# EAGLE design Neato Laser USB (EAGLE 6.2)
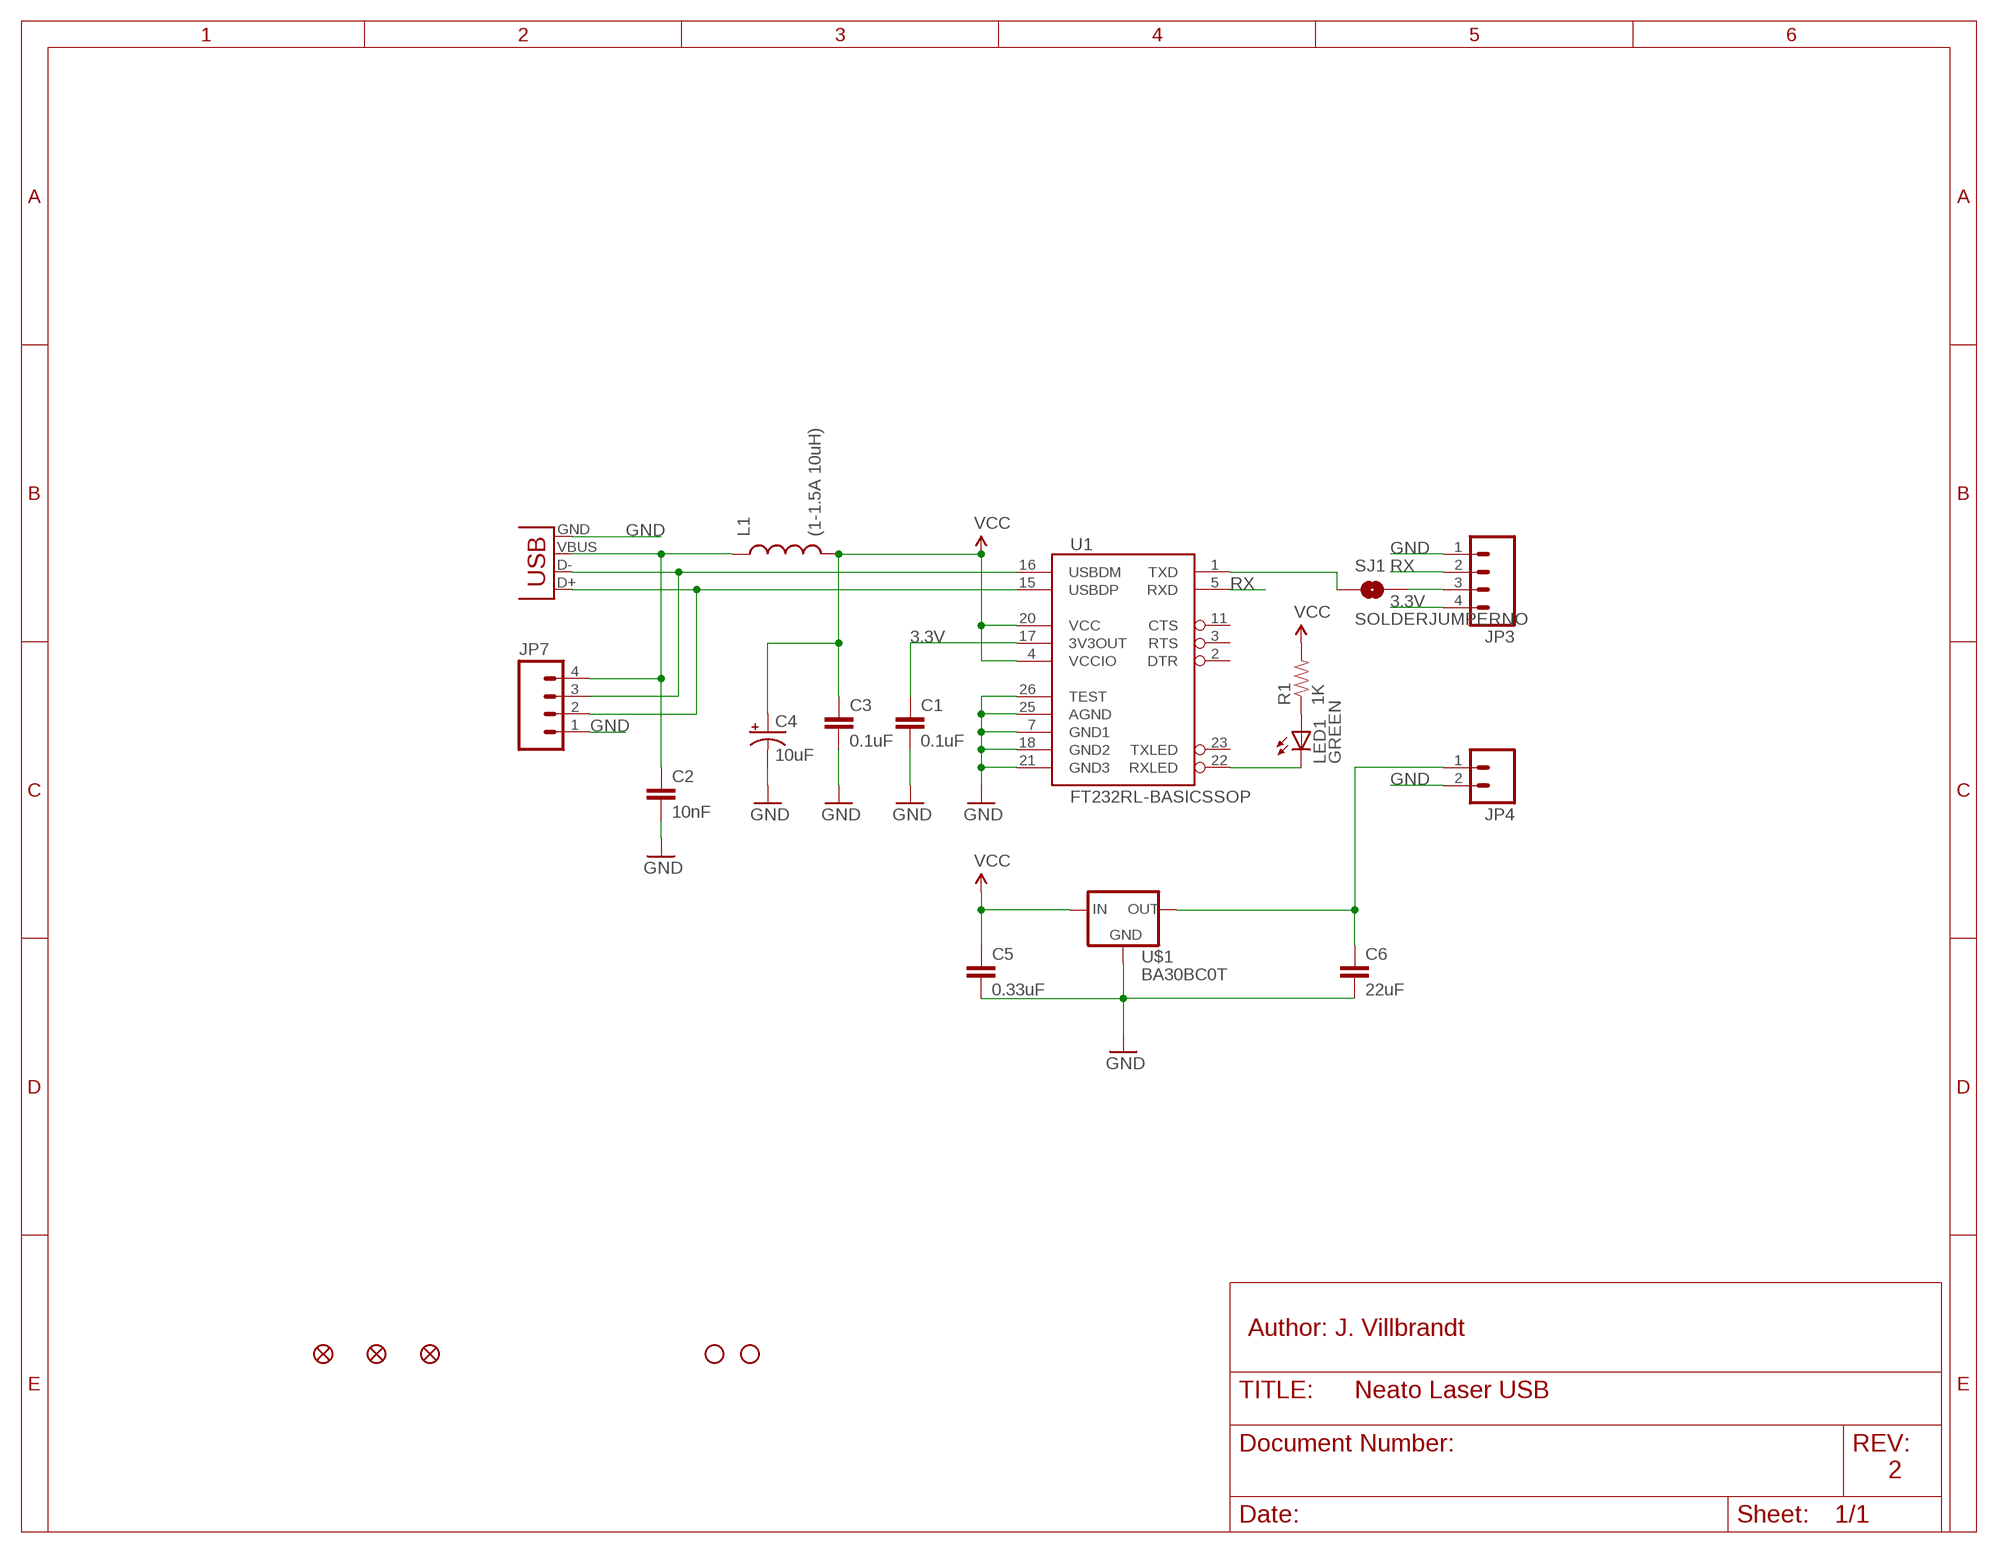
[diagram p0: schematic, sheet 1]

## Parts
C1  0.1uF  CAP0603-CAP  [0603-CAP]
C2  10nF  CAP0603-CAP  [0603-CAP]
C3  0.1uF  CAP0603-CAP  [0603-CAP]
C4  10uF  CAP_POL1206  [EIA3216]
C5  0.33uF  CAP0603-CAP  [0603-CAP]
C6  22uF  CAP0603-CAP  [0603-CAP]
JP1  STAND-OFF  [STAND-OFF]
JP2  STAND-OFF  [STAND-OFF]
JP3  M04JST-PTH  [JST-4-PTH]
JP4  M02JST-PTH-2  [JST-2-PTH]
JP5  FIDUCIAL1X2.5  [FIDUCIAL-1X2.5]
JP6  FIDUCIAL1X2.5  [FIDUCIAL-1X2.5]
JP7  M04PTH  [1X04]
JP8  FIDUCIAL1X2.5  [FIDUCIAL-1X2.5]
L1  (1-1.5A 10uH)  INDUCTOR0603  [0603]
LED1  GREEN  LED0603  [LED-0603]
R1  1K  RESISTOR0402-RES  [0402-RES]
SJ1  SOLDERJUMPERNO  [SJ_2S-NO]
U1  FT232RL-BASICSSOP  [SSOP28DB]
U$1  BA30BC0T  BA15BC0WT  [78XXL]
X1  USBSMD  [USB-MINIB]

## Nets
3.0V: C6.1 JP4.1 U$1.OUT
3.3V: C1.1 JP3.4 U1.17(3V3OUT)
GND: C1.2 C2.2 C3.2 C4.C(-) C5.2 C6.2 JP3.1 JP4.2 JP7.1 U1.7(GND1) U1.18(GND2) U1.21(GND3) U1.25(AGND) U1.26(TEST) U$1.GND X1.GND
N$1: JP7.3 U1.16(USBDM) X1.D-
N$2: JP7.2 U1.15(USBDP) X1.D+
N$3: C2.1 JP7.4 L1.1 X1.VBUS
N$4: LED1.C U1.22(RXLED)
N$5: LED1.A R1.1
N$6: JP3.3 SJ1.2
N$7: SJ1.1 U1.1(TXD)
RX: JP3.2 U1.5(RXD)
VCC: C3.1 C4.A(+) C5.1 L1.2 R1.2 U1.4(VCCIO) U1.20(VCC) U$1.IN
Unconnected: U1.2(DTR) U1.3(RTS) U1.11(CTS) U1.23(TXLED)

## Notes on the sheet
- Author: J. Villbrandt
- 2

## Library data of the parts
C1-C3 C5 C6 = SparkFun:CAP: Capacitor Standard 0603 ceramic capacitor, and 0.1" leaded capacitor.
C4 = SparkFun:CAP_POL: Capacitor Polarized These are standard SMD and PTH capacitors. Normally 10uF, 47uF, and 100uF in electrolytic and tantalum varieties. Always verify the external diameter of the through hole cap, it varies with capacity, voltage, and manufacturer. The EIA devices should be standard.
JP1 JP2 = SparkFun:STAND-OFF: Stand Off This is the mechanical footprint for a #4 phillips button head screw. Use the keepout ring to avoid running the screw head into surrounding components. SKU : PRT-00447
JP3 JP7 = SparkFun:M04: Header 4 Standard 4-pin 0.1" header. Use with straight break away headers (SKU : PRT-00116), right angle break away headers (PRT-00553), swiss pins (PRT-00743), machine pins (PRT-00117), and female headers (PRT-00115). Molex polarized connector foot print use with SKU : PRT-08231 with associated crimp pins and housings. 1MM SMD Version SKU: PRT-10208
JP4 = SparkFun:M02: Header 2 Standard 2-pin 0.1" header. Use with straight break away headers (SKU : PRT-00116), right angle break away headers (PRT-00553), swiss pins (PRT-00743), machine pins (PRT-00117), and female headers (PRT-00115). Molex polarized connector foot print use with SKU : PRT-08233 with associated crimp pins and housings.
JP5 JP6 JP8 = SparkFun:FIDUCIAL: Fiducial Alignment Points Various fiducial points for machine vision alignment.
L1 = SparkFun:INDUCTOR: Inductors Basic Inductor/Choke - 0603 and 1206. Footprints are not proven and vary greatly between part numbers.
LED1 = SparkFun:LED: LEDs Standard schematic elements and footprints for 5mm, 3mm, 1206, and 0603 sized LEDs. 5mm - Spark Fun Electronics SKU : COM-00529 (and others)
R1 = SparkFun:RESISTOR: Resistor Basic schematic elements and footprints for 0603, 1206, and PTH resistors.
SJ1 = SparkFun:SOLDERJUMPER: Solder Jumper Standard SMD solder jumper. Used to automate production. Two varients : Normally Open and Normally Closed are the same, but have different paste layers. NC will have a large amount of paste and should jumper during reflow.
U1 = SparkFun:FT232RL-BASIC: USB UART This is the simplified version of the FT232RL unit. Only what you need, nothing you don't. Spark Fun Electronics SKU : COM-00650
U$1 = Josh:BA15BC0WT: LD1117VXX voltage regulator. We carry the 3.3V version (COM-00526) in TO-220 package.
X1 = SparkFun:USB: USB Connectors USB-B-PTH is fully proven SKU : PRT-00139 USB-miniB is fully proven SKU : PRT-00587 USB-A-PCB is untested. USB-A-H is throughly reviewed, but untested. Spark Fun Electronics SKU : PRT-00437 USB-B-SMT is throughly reviewed, but untested. Needs silkscreen touching up. USB-A-S has not been used/tested USB-MB-H has not been used/tested

## Board
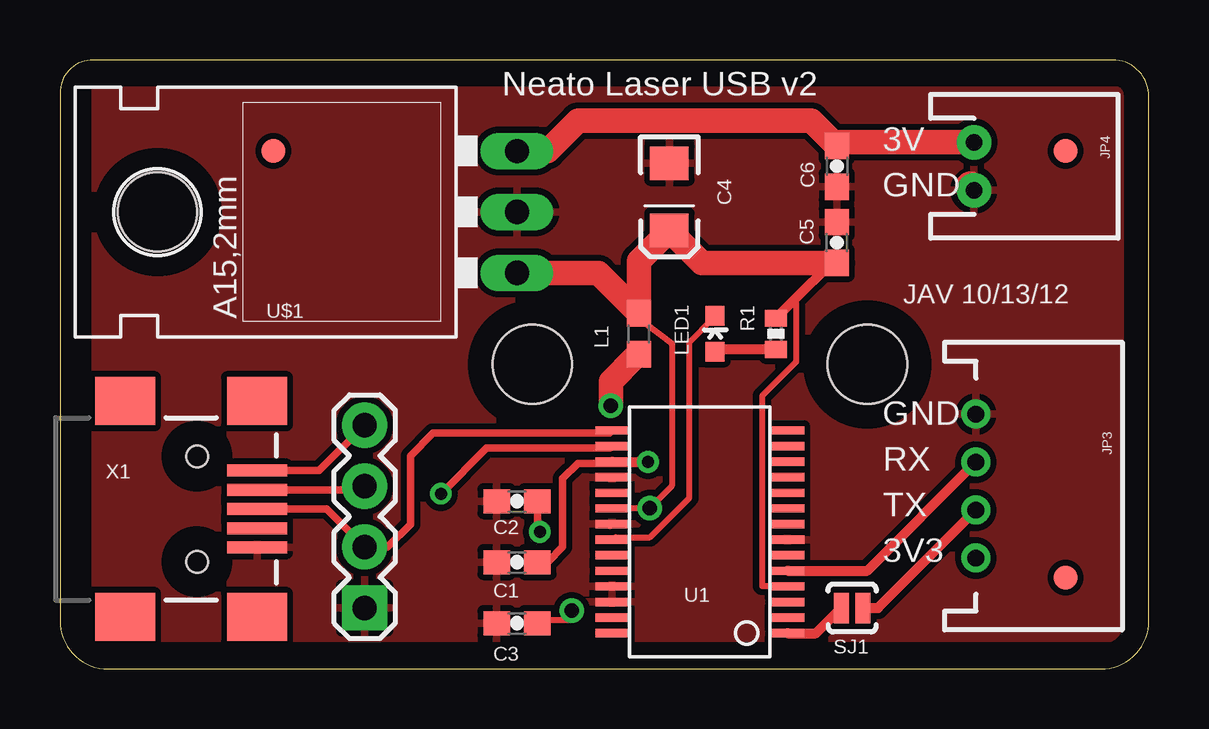
[diagram p1: board, top side]
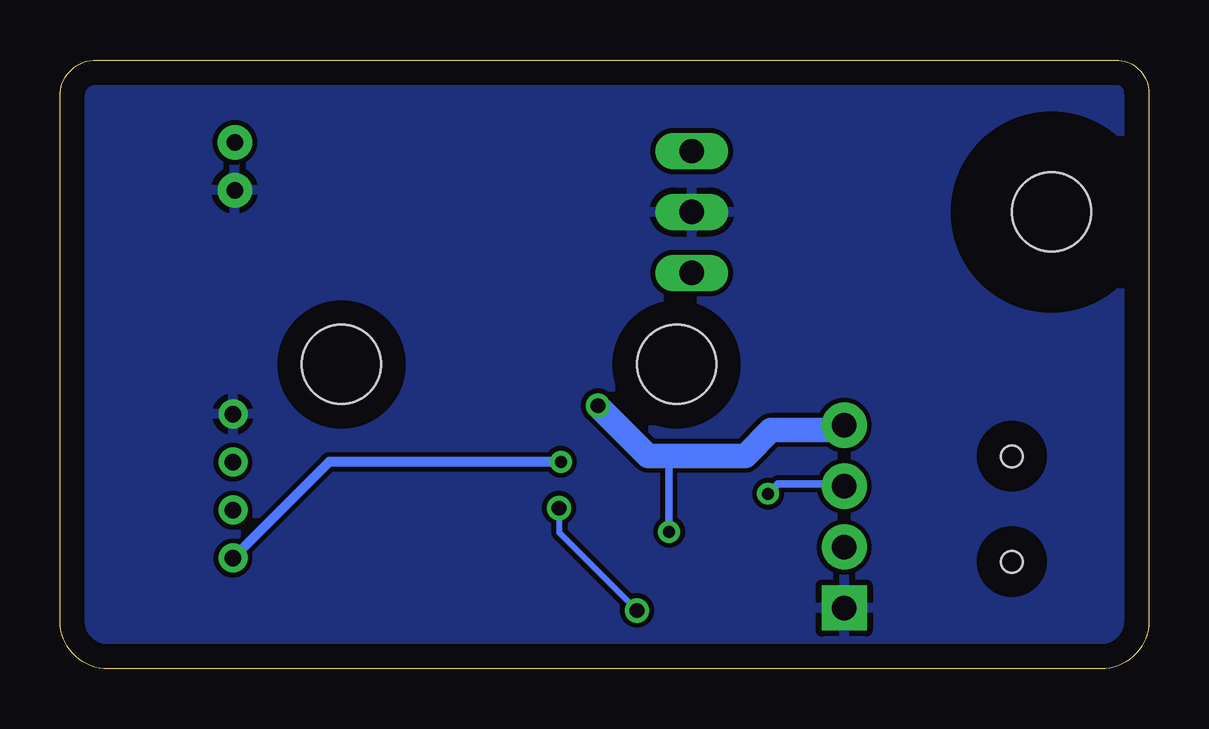
[diagram p2: board, bottom side, seen from below]

Size 45.39 x 25.39 mm. Coordinates in mm from the lower left corner, seen from the top.
Outline: 0,24 0,2 arc90 2,0 43.39,0 arc90 45.39,2 45.39,23.87 arc90 43.87,25.39 1.39,25.39 arc90 0,24
Copper layers (1*16): Top 0.035mm / dielectric 1.5mm / Bottom 0.035mm
Design rules: minimum track width 10mil, minimum drill 15mil, track to track 8mil, track to pad 8mil, pad to pad 8mil, via to via 8mil, smd to smd 8mil, copper to edge 40mil, drill to drill 8mil, minimum pad ring 10mil, minimum via ring 8mil, stop-mask expansion 4mil, vias tented up to drill 0mil, thermal gap 10mil

### Footprints (pad centres in the part's own frame; a part is rotated, then mirrored left to right if it is on the bottom)
0603-CAP = smd 1.1 x 1: 1 -0.85,0; 2 0.85,0
EIA3216 = smd 1.4 x 1.6: A 1.4,0; C -1.4,0
STAND-OFF = hole 3.302: 0,0
JST-4-PTH = drill 0.7: 1 -3,-5; 2 -1,-5; 3 1,-5; 4 3,-5
JST-2-PTH = drill 0.7 pad 1.448: 1 -1,0; 2 1,0
FIDUCIAL-1X2.5 = smd 1 x 1: 1 0,0
1X04 = drill 1.016 pad 1.88 square: 1 0,0 | drill 1.016 pad 1.88: 2 2.54,0; 3 5.08,0; 4 7.62,0
0603 = smd 1.1 x 1: 1 -0.85,0; 2 0.85,0
LED-0603 = smd 0.8 x 0.8: A 0,-0.75; C 0,0.75
0402-RES = smd 0.7 x 0.9: 1 -0.65,0; 2 0.65,0
SJ_2S-NO = smd 0.635 x 1.27: 1 -0.45,0; 2 0.45,0
SSOP28DB = smd 0.348 x 1.397: 1 -4.225,-3.656; 2 -3.575,-3.656; 3 -2.925,-3.656; 4 -2.275,-3.656; 5 -1.625,-3.656; 6 -0.975,-3.656; 7 -0.325,-3.656; 8 0.325,-3.656; 9 0.975,-3.656; 10 1.625,-3.656; 11 2.275,-3.656; 12 2.925,-3.656; 13 3.575,-3.656; 14 4.225,-3.656; 15 4.225,3.656; 16 3.575,3.656; 17 2.925,3.656; 18 2.275,3.656; 19 1.625,3.656; 20 0.975,3.656; 21 0.325,3.656; 22 -0.325,3.656; 23 -0.975,3.656; 24 -1.625,3.656; 25 -2.275,3.656; 26 -2.925,3.656; 27 -3.575,3.656; 28 -4.225,3.656
78XXL = drill 1.016 long: GND 0,-3.81; IN -2.54,-3.81; OUT 2.54,-3.81 | hole 3.302: 0,11.176
USB-MINIB = smd 2.5 x 0.5: D+ 2.5,0; D- 2.5,0.8; GND 2.5,-1.6; ID 2.5,-0.8; VBUS 2.5,1.6 | smd 2.5 x 2: MTN1 -3,4.5; MTN2 2.5,4.5; MTN3 -3,-4.5; MTN4 2.5,-4.5 | hole 0.9: 0,2.2; 0,-2.2

### Placement (x,y rotation side)
C1  19.05,4.45 180 top
C2  19.05,6.99 180 top
C3  19.05,1.91 180 top
C4  25.4,19.68 270 top
C5  32.38,17.78 90 top
C6  32.38,20.95 270 top
JP1  19.68,12.7 0 top
JP2  33.66,12.7 0 top
JP3  43.18,7.62 270 top
JP4  38.1,20.95 270 top
JP5  8.89,21.59 0 top
JP6  41.91,3.81 0 top
JP7  12.7,2.54 90 top
JP8  41.91,21.59 0 top
L1  24.13,13.97 90 top
LED1  27.3,13.97 0 top
R1  29.84,13.97 90 top
SJ1  33.02,2.54 0 top
U1  26.67,5.71 90 top
U$1  15.24,19.05 90 top
X1  5.71,6.67 0 top

### Tracks (layer width: path | path; a pad name or v marks a point on that pad's centre or on a via)
3.0V
  Top 1.016: U$1.OUT 20.32,21.59 21.59,22.86 31.33,22.86 C6.1 32.53,21.95 JP4.1
3.3V  (via drill 0.51)
  Top 0.254: 19.91,4.47 C1.1 | 22.96,8.53 U1.17
  Top 0.305: 19.91,4.47 20.34,4.47 20.95,5.08 20.95,7.94 21.59,8.57 22.95,8.57 U1.17
  Top 0.406: U1.17 v24.51,8.64
  Bottom 0.406: v24.51,8.64 34.16,8.64 JP3.4
GND
  Top 0.305: U1.7
  Top 1.016: 25.27,20.95 C4.C
  Top 1.27: 37.95,20.11 JP4.2
  pour Bottom: 0,0 0,25.4 45.72,25.4 45.72,0
  pour Top (isolate 0.254): 1.47,24.13 44.45,24.13 44.45,1.27 1.47,1.27
N$1  (via drill 0.5)
  Top 0.254: 22.96,9.35 U1.16
  Top 0.305: X1.D- 12.55,7.47 JP7.3 | v15.88,7.3 17.78,9.21 22.93,9.21 U1.16
  Bottom 0.254: 12.8,7.72 JP7.3
  Bottom 0.305: 12.8,7.72 15.46,7.72 v15.88,7.3
N$2
  Top 0.254: 22.96,9.96 U1.15 | 12.39,5.49 JP7.2
  Top 0.305: X1.D+ 11.11,6.67 JP7.2 13.65,5.08 14.61,6.03 14.61,8.89 15.56,9.84 22.92,9.84 U1.15
N$3  (via drill 0.5, 0.61)
  Top 0.254: 19.71,6.91 C2.1 | 23.98,13.01 L1.1
  Top 0.305: X1.VBUS 10.81,8.27 JP7.4 | C2.1 19.9,5.82 v20,5.71
  Top 1.016: 23.98,13.01 22.96,11.99 v22.96,10.97
  Bottom 0.254: 12.8,10.16 JP7.4
  Bottom 0.305: v20,5.71 20,8.57 20.32,8.89
  Bottom 1.016: 12.8,10.16 13.01,9.96 15.76,9.96 16.83,8.89 20.32,8.89 20.88,8.89 v22.96,10.97
N$4
  Top 0.254: LED1.C 27.23,14.63 26.24,13.64 26.24,7.14 24.59,5.49 23.16,5.49 U1.22
N$5
  Top 0.406: R1.1 27.41,13.32 LED1.A
N$6
  Top 0.406: SJ1.2 34.1,2.54 JP3.3
N$7
  Top 0.406: U1.1 31.52,1.49 SJ1.1
RX
  Top 0.406: U1.5 33.65,4.09 JP3.2
VCC  (via drill 0.61)
  Top 0.254: v21.34,2.44 21.34,2.03 19.91,2.03 C3.1 | U1.20 23.16,6.71 v24.59,6.71 25.5,7.62 25.5,13.56 24.38,14.43 L1.2 | U1.4 30.28,3.45 29.26,3.45 29.26,11.38 30.68,12.8 30.68,15.24 30.57,15.35
  Top 0.406: C5.1 32.16,16.93 30.57,15.35 R1.2
  Top 1.016: U$1.IN 22.44,16.51 L1.2 24.13,17.02 C4.A 26.75,16.93 C5.1
  Bottom 0.254: v21.34,2.44 24.59,5.69 v24.59,6.71

### Text on the board
tPlace: Neato Laser USB v2 | 3V | GND | JAV 10/13/12 | GND | RX | TX | 3V3